# Altium schematic sheet EthernetSBand.SchDoc
size OrCAD B; SheetNumber: 7; SheetTotal: 12
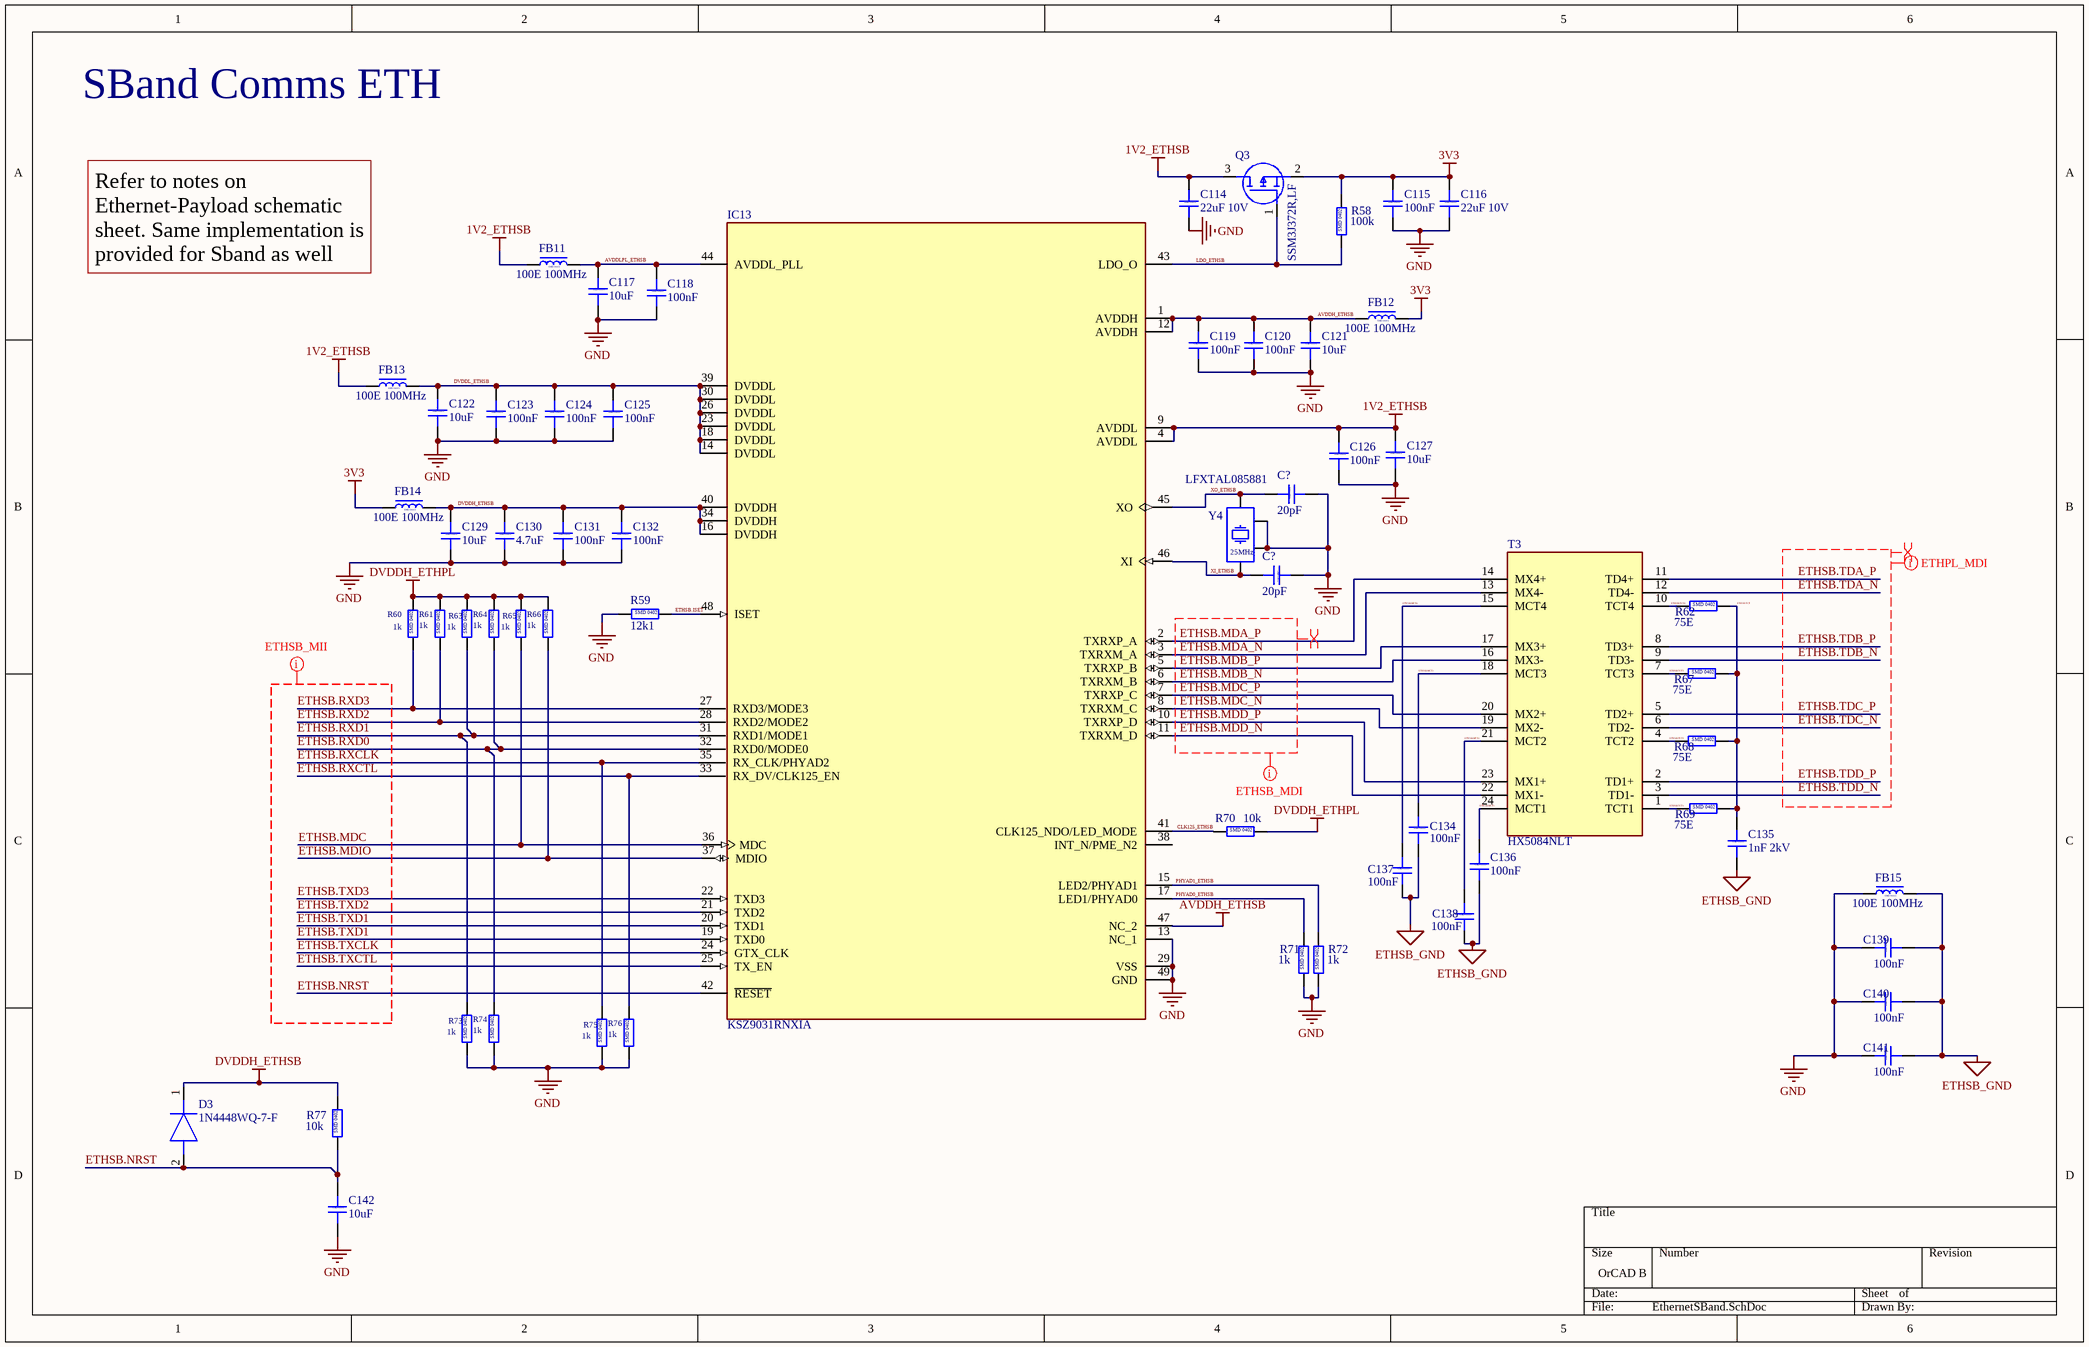
[diagram p0: EthernetSBand.SchDoc]

## Parts
(Parts that share a designator on the sheet are numbered #1, #2 ... from top to bottom, then left to right.)
C114  22uF 10V  [CAP_0805]
C115  100nF  [CAP_0402]
C116  22uF 10V  [CAP_0805]
C117  10uF  [CAP_0603]
C118  100nF  [CAP_0402]
C119  100nF  [CAP_0402]
C120  100nF  [CAP_0402]
C121  10uF  [CAP_0603]
C122  10uF  [CAP_0603]
C123  100nF  [CAP_0402]
C124  100nF  [CAP_0402]
C125  100nF  [CAP_0402]
C126  100nF  [CAP_0402]
C127  10uF  [CAP_0603]
C129  10uF  [CAP_0603]
C130  4.7uF  [CAP_0603]
C131  100nF  [CAP_0402]
C132  100nF  [CAP_0402]
C134  100nF  [CAP_0402]
C135  1nF 2kV  [CAP_0402]
C136  100nF  [CAP_0402]
C137  100nF  [CAP_0402]
C138  100nF  [CAP_0402]
C139  100nF  [CAP_0402]
C140  100nF  [CAP_0402]
C141  100nF  [CAP_0402]
C142  10uF  [CAP_0603]
C?#1  20pF  [CAP_0402]
C?#2  20pF  [CAP_0402]
D3  1N4448WQ-7-F  [SOD3716X135N]
FB11  100E 100MHz  [FB_0603]
FB12  100E 100MHz  [FB_0603]
FB13  100E 100MHz  [FB_0603]
FB14  100E 100MHz  [FB_0603]
FB15  100E 100MHz  [FB_0603]
IC13  KSZ9031RNXIA  [QFN50P700X700X90-49N]
Q3  SSM3J372R,LF  [SSM3J372RLF]
R58  100k  [RES_0402]
R59  12k1  [RES_0402]
R60  1k  [RES_0402]
R61  1k  [RES_0402]
R62  75E  [RES_0402]
R63  1k  [RES_0402]
R64  1k  [RES_0402]
R65  1k  [RES_0402]
R66  1k  [RES_0402]
R67  75E  [RES_0402]
R68  75E  [RES_0402]
R69  75E  [RES_0402]
R70  10k  [RES_0402]
R71  1k  [RES_0402]
R72  1k  [RES_0402]
R73  1k  [RES_0402]
R74  1k  [RES_0402]
R75  1k  [RES_0402]
R76  1k  [RES_0402]
R77  10k  [RES_0402]
T3  HX5084NLT  [HX5084NLT]
Y4  LFXTAL085881  [CRY-SMD-3225]

## Nets
1V2_ETHSB: C114.1 C126.1 C127.1 FB11.1 FB13.1 IC13.4(AVDDL) IC13.9(AVDDL) Q3.3(D)
3V3: C115.1 C116.1 FB12.2 FB14.1 Q3.2(S) R58.2
AVDDH_ETHSB: C119.1 C120.1 C121.1 FB12.1 IC13.1(AVDDH) IC13.12(AVDDH) IC13.47(NC_2)
DVDDH_ETHPL: R60.2 R61.2 R63.2 R64.2 R65.2 R66.2 R70.2
DVDDH_ETHSB: C129.1 C130.1 C131.1 C132.1 D3.1(K) FB14.2 IC13.16(DVDDH) IC13.34(DVDDH) IC13.40(DVDDH) R77.2
ETHSB_GND: C134.2 C135.2 C136.2 C137.2 C138.2 C139.2 C140.2 C141.2 FB15.2
GND: C114.2 C115.2 C116.2 C117.2 C118.2 C119.2 C120.2 C121.2 C122.2 C123.2 C124.2 C125.2 C126.2 C127.2 C129.2 C130.2 C131.2 C132.2 C139.1 C140.1 C141.1 C142.2 C?#1.2 C?#2.1 FB15.1 IC13.13(NC_1) IC13.29(VSS) IC13.49(GND) R59.1 R71.1 R72.1 R73.1 R74.1 R75.1 R76.1 Y4.2 Y4.4
AVDDLPL_ETHSB: C117.1 C118.1 FB11.2 IC13.44(AVDDL_PLL)
CLK125_ETHSB: IC13.41(CLK125_NDO/LED_MODE) R70.1
DVDDL_ETHSB: C122.1 C123.1 C124.1 C125.1 FB13.2 IC13.14(DVDDL) IC13.18(DVDDL) IC13.23(DVDDL) IC13.26(DVDDL) IC13.30(DVDDL) IC13.39(DVDDL)
ETHSB.ISET: IC13.48(ISET) R59.2
ETHSB.MCT1: C136.1 T3.24(MCT1)
ETHSB.MCT2: C138.1 T3.21(MCT2)
ETHSB.MCT3: C134.1 T3.18(MCT3)
ETHSB.MCT4: C137.1 T3.15(MCT4)
ETHSB.MDA_N: IC13.3(TXRXM_A) T3.13(MX4-)
ETHSB.MDA_P: IC13.2(TXRXP_A) T3.14(MX4+)
ETHSB.MDB_N: IC13.6(TXRXM_B) T3.16(MX3-)
ETHSB.MDB_P: IC13.5(TXRXP_B) T3.17(MX3+)
ETHSB.MDC: IC13.36(MDC) R65.1
ETHSB.MDC_N: IC13.8(TXRXM_C) T3.19(MX2-)
ETHSB.MDC_P: IC13.7(TXRXP_C) T3.20(MX2+)
ETHSB.MDD_N: IC13.11(TXRXM_D) T3.22(MX1-)
ETHSB.MDD_P: IC13.10(TXRXP_D) T3.23(MX1+)
ETHSB.MDIO: IC13.37(MDIO) R66.1
ETHSB.NRST: C142.1 D3.2(A) IC13.42(~{RESET}) R77.1
ETHSB.RXCLK: IC13.35(RX_CLK/PHYAD2) R75.2
ETHSB.RXCTL: IC13.33(RX_DV/CLK125_EN) R76.2
ETHSB.RXD0: IC13.32(RXD0/MODE0) R64.1 R74.2
ETHSB.RXD1: IC13.31(RXD1/MODE1) R63.1 R73.2
ETHSB.RXD2: IC13.28(RXD2/MODE2) R61.1
ETHSB.RXD3: IC13.27(RXD3/MODE3) R60.1
ETHSB.TCT: C135.1 R62.2 R67.2 R68.2 R69.2
ETHSB.TCT1: R69.1 T3.1(TCT1)
ETHSB.TCT2: R68.1 T3.4(TCT2)
ETHSB.TCT3: R67.1 T3.7(TCT3)
ETHSB.TCT4: R62.1 T3.10(TCT4)
ETHSB.TDA_N: T3.12(TD4-)
ETHSB.TDA_P: T3.11(TD4+)
ETHSB.TDB_N: T3.9(TD3-)
ETHSB.TDB_P: T3.8(TD3+)
ETHSB.TDC_N: T3.6(TD2-)
ETHSB.TDC_P: T3.5(TD2+)
ETHSB.TDD_N: T3.3(TD1-)
ETHSB.TDD_P: T3.2(TD1+)
ETHSB.TXCLK: IC13.24(GTX_CLK)
ETHSB.TXCTL: IC13.25(TX_EN)
ETHSB.TXD1: IC13.19(TXD0) IC13.20(TXD1)
ETHSB.TXD2: IC13.21(TXD2)
ETHSB.TXD3: IC13.22(TXD3)
LDO_ETHSB: IC13.43(LDO_O) Q3.1(G) R58.1
PHYAD0_ETHSB: IC13.17(LED1/PHYAD0) R71.2
PHYAD1_ETHSB: IC13.15(LED2/PHYAD1) R72.2
XI_ETHSB: C?#2.2 IC13.46(XI) Y4.1
XO_ETHSB: C?#1.1 IC13.45(XO) Y4.3

Not connected (* = marked no-connect by the designer): IC13 38(INT_N/PME_N2)

## Layout directives
net class ETHSB_MII; rule Maximum Via Count Constraint [Max Count = 2]; rule Matched Net Lengths [Delay Tolerance = 360ps]: ETHSB.MDC, ETHSB.MDIO, ETHSB.NRST, ETHSB.RXCLK, ETHSB.RXCTL, ETHSB.RXD0, ETHSB.RXD1, ETHSB.RXD2, ETHSB.RXD3, ETHSB.TXCLK, ETHSB.TXCTL, ETHSB.TXD1, ETHSB.TXD2, ETHSB.TXD3
differential pair: ETHSB.MDA_N, ETHSB.MDA_P, ETHSB.MDB_N, ETHSB.MDB_P, ETHSB.MDC_N, ETHSB.MDC_P, ETHSB.MDD_N, ETHSB.MDD_P, ETHSB.TDA_N, ETHSB.TDA_P, ETHSB.TDB_N, ETHSB.TDB_P, ETHSB.TDC_N, ETHSB.TDC_P, ETHSB.TDD_N, ETHSB.TDD_P
net class ETHSB_MDI; rule Maximum Via Count Constraint [Max Count = 2]; rule Matched Net Lengths [Delay Tolerance = 100ps]: ETHSB.MDA_N, ETHSB.MDA_P, ETHSB.MDB_N, ETHSB.MDB_P, ETHSB.MDC_N, ETHSB.MDC_P, ETHSB.MDD_N, ETHSB.MDD_P, ETHSB.TDA_N, ETHSB.TDA_P, ETHSB.TDB_N, ETHSB.TDB_P, ETHSB.TDC_N, ETHSB.TDC_P, ETHSB.TDD_N, ETHSB.TDD_P

## Notes on the sheet
- SBand Comms ETH
- Refer to notes on Ethernet-Payload schematic sheet. Same implementation is provided for Sband as well
- (in symbol Capacitor-SMD-0402) SMD 0402
- (in symbol Capacitor-SMD-0603) SMD 0603
- (in symbol Capacitor-SMD-0805) SMD 0805
- (in symbol FB_0603) SMD 0603
- (in symbol LFXTAL085881) 25MHz
- (in symbol Resistor-SMD-0402) SMD 0402

## Library data of the parts
C114 C116 = Capacitor-SMD-0805: Capacitor SMD 0805 RATED
C115 C118-C120 C123-C126 C131 C132 C134-C141 C?#1 C?#2 = Capacitor-SMD-0402: Capacitor SMD 0402 RATED
C117 C121 C122 C127 C129 C130 C142 = Capacitor-SMD-0603: Capacitor SMD 0603 RATED
D3 = 1N4448WQ-7-F: Diode 100V 4A; Manufacturer_Name: Diodes Incorporated; Datasheet Link: http://www.mouser.com/ds/2/115/ds12002-536532.pdf; Height: 1.35mm; Manufacturer_Part_Number: 1N4448WQ-7-F; Mouser Part Number: 621-1N4448WQ-7-F; Mouser Price/Stock: https://www.mouser.co.uk/ProductDetail/Diodes-Incorporated/1N4448WQ-7-F?qs=s5XU71A7K78gaRcR8oskdg%3D%3D; Arrow Part Number: 1N4448WQ-7-F; Arrow Price/Stock: https://www.arrow.com/en/products/1n4448wq-7-f/diodes-incorporated?utm_currency=USD&region=nac
FB11-FB15 = FB_0603: Ferrite Bead SMD 0603; Manufacturer: *; Manufacturer Part Number: *; Distributor Link: *; LCSC: *
IC13 = KSZ9031RNXIA: RGMII Ethernet Transceiver with VDDL LDO; Manufacturer_Name: Microchip; Datasheet Link: https://ww1.microchip.com/downloads/en/devicedoc/00002117f.pdf; Height: 0.9mm; Manufacturer_Part_Number: KSZ9031RNXIA; Mouser Part Number: 998-KSZ9031RNXIA; Mouser Price/Stock: https://www.mouser.co.uk/ProductDetail/Microchip-Technology/KSZ9031RNXIA?qs=lBdOJv1PVCGadCZMzb63mg%3D%3D; Arrow Part Number: KSZ9031RNXIA; Arrow Price/Stock: https://www.arrow.com/en/products/ksz9031rnxia/microchip-technology?region=europe
Q3 = SSM3J372R,LF: MOSFET (P-Channel); Manufacturer_Name: Toshiba; Datasheet Link: https://toshiba.semicon-storage.com/ap-en/semiconductor/product/mosfets/detail.SSM3J372R.html; Height: 0.88mm; Manufacturer_Part_Number: SSM3J372R,LF; Mouser Part Number: 757-SSM3J372RLF; Mouser Price/Stock: https://www.mouser.co.uk/ProductDetail/Toshiba/SSM3J372RLF?qs=u16ybLDytRbJaSMlwq9MLA%3D%3D; Arrow Part Number: SSM3J372R,LF; Arrow Price/Stock: null?utm_currency=USD&region=nac
R58-R77 = Resistor-SMD-0402: Resistor SMD 0402 RATED
T3 = HX5084NLT: Ethernet Signal Transformer; Manufacturer_Name: YAGEO; Datasheet Link: https://productfinder.pulseelectronics.com/api/open/part-attachments/datasheet/hx5084nlt; Height: 4.1402mm; Manufacturer_Part_Number: HX5084NLT; Mouser Part Number: 673-HX5084NLT; Mouser Price/Stock: https://www.mouser.co.uk/ProductDetail/Pulse-Electronics/HX5084NLT?qs=afupL77xwePI46UjbaB5Gg%3D%3D; Arrow Part Number: HX5084NLT; Arrow Price/Stock: https://www.arrow.com/en/products/hx5084nlt/pulse-electronics-corporation?utm_currency=USD&region=nac
Y4 = LFXTAL085881: Crystal Oscillator 25MHz; Manufacturer_Name: IDQ; Datasheet Link: https://www.mouser.in/datasheet/3/1460/1/LFXTAL085881.pdf; Height: 0.8mm; Manufacturer_Part_Number: LFXTAL085881